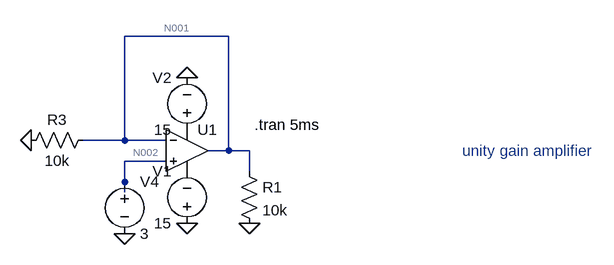
[diagram p0: schematic unity gain amp.asc]
unity gain amp.asc, the LTspice schematic file:
Version 4
SHEET 1 924 680
WIRE 272 0 112 0
WIRE 112 160 112 0
WIRE 112 160 48 160
WIRE 176 160 112 160
WIRE 272 176 272 0
WIRE 272 176 240 176
WIRE 304 176 272 176
WIRE 176 192 112 192
WIRE 304 208 304 176
WIRE 112 224 112 192
WIRE 112 240 112 224
FLAG 208 288 0
FLAG 304 288 0
FLAG 112 304 0
FLAG -32 160 0
FLAG 208 64 0
SYMBOL Opamps\\UniversalOpamp2 208 176 R0
SYMATTR InstName U1
SYMBOL res 288 192 R0
SYMATTR InstName R1
SYMATTR Value 10k
SYMBOL res 64 144 R90
WINDOW 0 0 56 VBottom 2
WINDOW 3 32 56 VTop 2
SYMATTR InstName R3
SYMATTR Value 10k
SYMBOL voltage 208 304 R180
WINDOW 0 24 96 Left 2
WINDOW 3 24 16 Left 2
WINDOW 123 0 0 Left 0
WINDOW 39 0 0 Left 0
SYMATTR InstName V1
SYMATTR Value 15
SYMBOL voltage 112 208 R0
WINDOW 123 0 0 Left 0
WINDOW 39 0 0 Left 0
SYMATTR InstName V4
SYMATTR Value 3
SYMBOL voltage 208 160 R180
WINDOW 0 24 96 Left 2
WINDOW 3 24 16 Left 2
WINDOW 123 0 0 Left 0
WINDOW 39 0 0 Left 0
SYMATTR InstName V2
SYMATTR Value 15
TEXT 312 136 Left 2 !.tran 5ms
TEXT 632 176 Left 2 ;unity gain amplifier

The netlist it stands for:
* unity gain amp.asc
XU1 N002 N001 P001 P002 N001 level.2 Avol=1Meg GBW=10Meg Slew=10Meg ilimit=25m rail=0 Vos=0 phimargin=45 en=0 enk=0 in=0 ink=0 Rin=500Meg  ; pins IN+ IN- V+ V- OUT
R1 N001 0 10k
R3 N001 0 10k
V1 0 P002 15
V4 N002 0 3
V2 P001 0 15
.tran 5ms
* unity gain amplifier
.lib UniversalOpamps2.sub
.backanno
.end

* Results of the author's LTspice run, read from the files saved beside the schematic
* Operating Point, zero values left out:
*   V(n001) = 3 V
*   V(p001) = 15 V
*   V(p002) = -15 V
*   V(n002) = 3 V
*   I(R3) = 300 µA
*   I(R1) = 300 µA
*   I(V2) = -1.798 mA
*   I(V4) = -6 nA
*   I(V1) = -1.198 mA
*   Ix(u1:1) = 6 nA
*   Ix(u1:2) = 6 nA
*   Ix(u1:3) = 1.798 mA
*   Ix(u1:4) = -1.198 mA
*   Ix(u1:5) = -600 µA